# Altium schematic sheet Sheet_1_2021-12-20.schdoc
size 57 x 40 mm
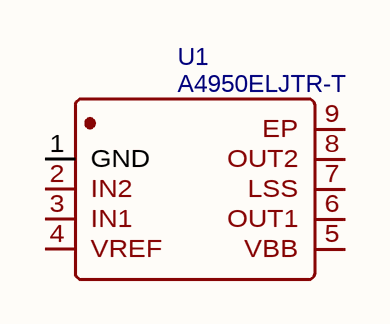
[diagram p0: Sheet_1_2021-12-20.schdoc]

## Parts
U1  A4950ELJTR-T  [SOIC-8_L4.9-W3.9-P1.27-LS6.0-BL-EP]

## Nets

Not connected (* = marked no-connect by the designer): U1 1(GND) 2(IN2) 3(IN1) 4(VREF) 5(VBB) 6(OUT1) 7(LSS) 8(OUT2) 9(EP)

## Library data of the parts
U1 = A4950ELJTR-T: BOM_Manufacturer: ALLEGRO; BOM_Supplier: LCSC; BOM_Manufacturer Part: A4950ELJTR-T; BOM_Supplier Part: C82404; BOM_JLCPCB Part Class: Extended Part; spicePre: U; spiceSymbolName: A4950ELJTR-T